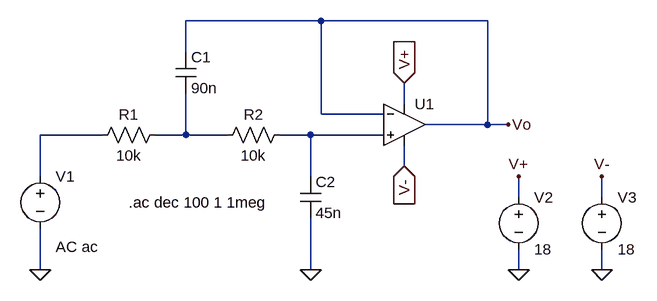
[diagram p0: schematic sallen_test.asc]
sallen_test.asc, the LTspice schematic file:
Version 4
SHEET 1 880 680
WIRE 144 16 -64 16
WIRE 400 16 144 16
WIRE -64 64 -64 16
WIRE 272 144 272 112
WIRE 144 160 144 16
WIRE 240 160 144 160
WIRE 400 176 400 16
WIRE 400 176 304 176
WIRE 432 176 400 176
WIRE -192 192 -288 192
WIRE -64 192 -64 128
WIRE -64 192 -112 192
WIRE 0 192 -64 192
WIRE 128 192 80 192
WIRE 240 192 128 192
WIRE 272 240 272 208
WIRE -288 256 -288 192
WIRE 128 256 128 192
WIRE 448 288 448 256
WIRE 576 288 576 256
WIRE -288 400 -288 336
WIRE 128 400 128 320
WIRE 448 400 448 368
WIRE 576 400 576 368
FLAG 128 400 0
FLAG 448 256 V+
FLAG 576 256 V-
FLAG 448 400 0
FLAG 576 400 0
FLAG -288 400 0
FLAG 272 240 V-
IOPIN 272 240 In
FLAG 272 112 V+
IOPIN 272 112 In
FLAG 432 176 Vo
SYMBOL res -96 176 R90
WINDOW 0 0 56 VBottom 2
WINDOW 3 32 56 VTop 2
SYMATTR InstName R1
SYMATTR Value 10k
SYMBOL res 96 176 R90
WINDOW 0 0 56 VBottom 2
WINDOW 3 32 56 VTop 2
SYMATTR InstName R2
SYMATTR Value 10k
SYMBOL cap -80 64 R0
SYMATTR InstName C1
SYMATTR Value 90n
SYMBOL cap 112 256 R0
SYMATTR InstName C2
SYMATTR Value 45n
SYMBOL voltage -288 240 R0
WINDOW 123 24 124 Left 2
WINDOW 39 0 0 Left 0
SYMATTR Value2 AC ac
SYMATTR InstName V1
SYMATTR Value ""
SYMBOL voltage 448 272 R0
WINDOW 123 0 0 Left 0
WINDOW 39 0 0 Left 0
SYMATTR InstName V2
SYMATTR Value 18
SYMBOL voltage 576 272 R0
WINDOW 123 0 0 Left 0
WINDOW 39 0 0 Left 0
SYMATTR InstName V3
SYMATTR Value 18
SYMBOL OpAmps\\UniversalOpAmp 272 176 R0
SYMATTR InstName U1
TEXT -152 296 Left 2 !.ac dec 100 1 1meg

The netlist it stands for:
* sallen_test.asc
R1 N002 N001 10k
R2 N003 N002 10k
C1 Vo N002 90n
C2 N003 0 45n
V1 N001 0 AC ac
V2 V+ 0 18
V3 V- 0 18
XU1 N003 Vo V+ V- Vo level1 Avol=1Meg GBW=10Meg Vos=0 En=0 Enk=0 In=0 Ink=0 Rin=500Meg  ; pins In+ In- V+ V- OUT
.ac dec 100 1 1meg
.lib UniversalOpAmp1.lib
.backanno
.end